# Altium project STM32_CustomQuad.PrjPcb
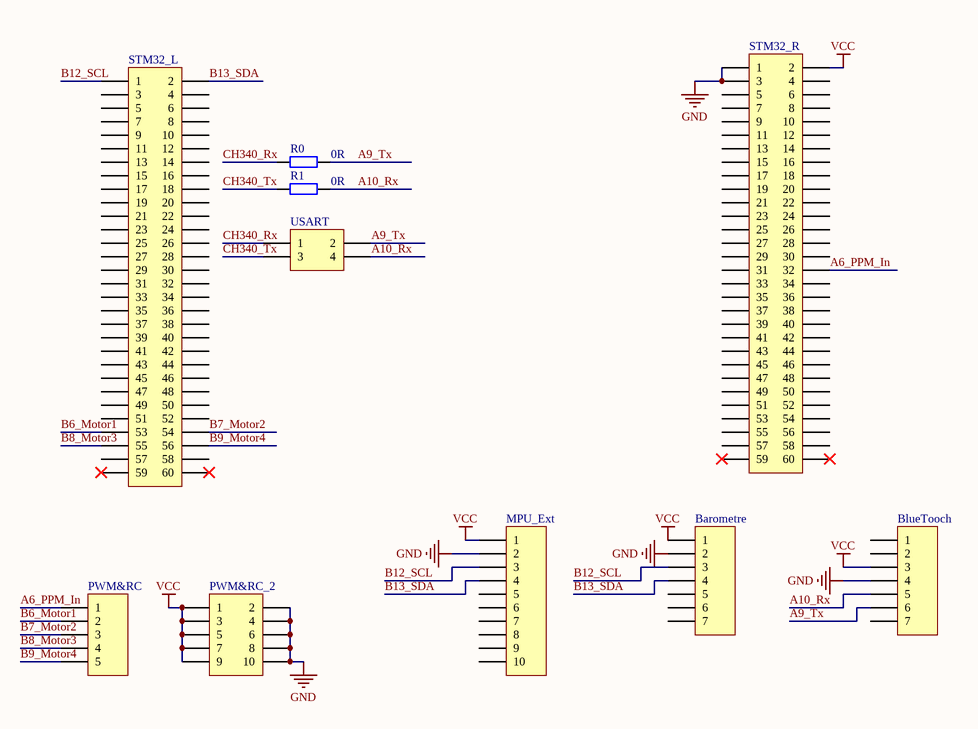
[diagram p0: main.SchDoc]
1 sheet, 10 parts. Net scope: global (net labels, ports and power ports of the same name join across sheets).
Board file: main.PcbDoc

## Sheet main.SchDoc
size A4

### Parts
Barometre  Header 7  [HDR1X7]  (value not drawn)
BlueTooch  Header 7  [HDR1X7]  (value not drawn)
MPU_Ext  Header 10  [HDR1X10]  (value not drawn)
PWM&RC  Header 5  [HDR1X5]  (value not drawn)
PWM&RC_2  Header 5X2  [HDR2X5]  (value not drawn)
R0  value 0R  [1210]  (hidden comment: Res2)
R1  value 0R  [1210]  (hidden comment: Res2)
STM32_L  Header 30X2  [HDR2X30]  (value not drawn)
STM32_R  Header 30X2  [HDR2X30]  (value not drawn)
USART  Header 2X2  [HDR2X2]  (value not drawn)

### Nets
GND: Barometre.2 BlueTooch.4 MPU_Ext.2 PWM&RC_2.2 PWM&RC_2.4 PWM&RC_2.6 PWM&RC_2.8 PWM&RC_2.10 STM32_R.1 STM32_R.3
VCC: Barometre.1 BlueTooch.3 MPU_Ext.1 PWM&RC_2.1 PWM&RC_2.3 PWM&RC_2.5 PWM&RC_2.7 PWM&RC_2.9 STM32_R.2
A6_PPM_In: PWM&RC.1 STM32_R.32
A9_Tx: BlueTooch.6 R0.2 USART.2
A10_Rx: BlueTooch.5 R1.2 USART.4
B6_Motor1: PWM&RC.2 STM32_L.53
B7_Motor2: PWM&RC.3 STM32_L.54
B8_Motor3: PWM&RC.4 STM32_L.55
B9_Motor4: PWM&RC.5 STM32_L.56
B12_SCL: Barometre.3 MPU_Ext.3 STM32_L.1
B13_SDA: Barometre.4 MPU_Ext.4 STM32_L.2
CH340_Rx: R0.1 USART.1
CH340_Tx: R1.1 USART.3

Not connected (* = marked no-connect by the designer): Barometre 5 6 7; BlueTooch 1 2 7; MPU_Ext 5 6 7 8 9 10; STM32_L 3 4 5 6 7 8 9 10 11 12 13 14 15 16 17 18 19 20 21 22 23 24 25 26 27 28 29 30 31 32 33 34 35 36 37 38 39 40 41 42 43 44 45 46 47 48 49 50 51 52 57 58 59* 60*; STM32_R 4 5 6 7 8 9 10 11 12 13 14 15 16 17 18 19 20 21 22 23 24 25 26 27 28 29 30 31 33 34 35 36 37 38 39 40 41 42 43 44 45 46 47 48 49 50 51 52 53 54 55 56 57 58 59* 60*

### Library data of the parts
Barometre BlueTooch = Header 7: Header, 7-Pin; LatestRevisionDate: 17-Jul-2002; LatestRevisionNote: Re-released for DXP Platform.; Publisher: Altium Limited
MPU_Ext = Header 10: Header, 10-Pin; LatestRevisionDate: 17-Jul-2002; LatestRevisionNote: Re-released for DXP Platform.; Publisher: Altium Limited
PWM&RC = Header 5: Header, 5-Pin; LatestRevisionDate: 17-Jul-2002; LatestRevisionNote: Re-released for DXP Platform.; Publisher: Altium Limited
PWM&RC_2 = Header 5X2: Header, 5-Pin, Dual row; LatestRevisionDate: 17-Jul-2002; LatestRevisionNote: Re-released for DXP Platform.; Publisher: Altium Limited
R0 R1 = Res2: Resistor; Published: 8-Jun-2000; LatestRevisionDate: 17-Jul-2002; LatestRevisionNote: Re-released for DXP Platform.; PackageReference: AXIAL-0.4; Publisher: Altium Limited; PackageDescription: Axial Device, Thru-Hole; 2 Leads; 0.4 in Pin Spacing
STM32_L STM32_R = Header 30X2: Header, 30-Pin, Dual row; LatestRevisionDate: 17-Jul-2002; LatestRevisionNote: Re-released for DXP Platform.; Publisher: Altium Limited
USART = Header 2X2: Header, 2-Pin, Dual row; LatestRevisionDate: 17-Jul-2002; LatestRevisionNote: Re-released for DXP Platform.; Publisher: Altium Limited